# Altium schematic sheet LCD.SchDoc
size A4
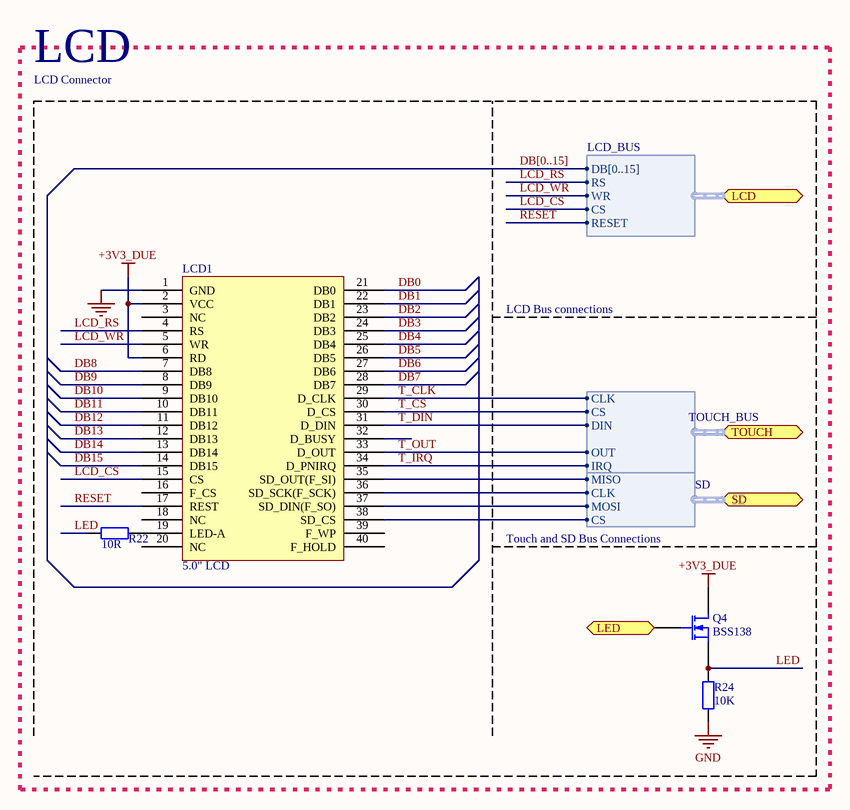
[diagram p0: LCD.SchDoc]

## Parts
LCD1  5.0" LCD  [TFT LCD 5.0 INCHES]
Q4  BSS138  [SOT23]
R22  10R  [RES1206]
R24  10K  [RES1206]

## Ports
LCD (harness LCD_BUS), LED, SD (harness SD), TOUCH (harness TOUCH_BUS)

## Harnesses
LCD_BUS: DB[0..15], RS, WR, CS, RESET
TOUCH_BUS: CLK, CS, DIN, OUT, IRQ
SD: MISO, MOSI, CLK, CS

## Nets
+3V3_DUE: LCD1.2(VCC) LCD1.6(RD) Q4.1(D)
GND: LCD1.1(GND) R24.2
DB0: LCD1.21(DB0)
DB1: LCD1.22(DB1)
DB2: LCD1.23(DB2)
DB3: LCD1.24(DB3)
DB4: LCD1.25(DB4)
DB5: LCD1.26(DB5)
DB6: LCD1.27(DB6)
DB7: LCD1.28(DB7)
DB8: LCD1.7(DB8)
DB9: LCD1.8(DB9)
DB10: LCD1.9(DB10)
DB11: LCD1.10(DB11)
DB12: LCD1.11(DB12)
DB13: LCD1.12(DB13)
DB14: LCD1.13(DB14)
DB15: LCD1.14(DB15)
LCD_CS: LCD1.15(CS) ; port LCD.CS
LCD_RS: LCD1.4(RS) ; port LCD.RS
LCD_WR: LCD1.5(WR) ; port LCD.WR
LED: Q4.2(S) R22.2 R24.1
LED: Q4.3(G) ; port LED  [a separate net that carries the same name]
RESET: LCD1.17(REST) ; port LCD.RESET
T_CLK: LCD1.29(D_CLK) ; port TOUCH.CLK
T_CS: LCD1.30(D_CS) ; port TOUCH.CS
T_DIN: LCD1.31(D_DIN) ; port TOUCH.DIN
T_IRQ: LCD1.34(D_PNIRQ) ; port TOUCH.IRQ
T_OUT: LCD1.33(D_OUT) ; port TOUCH.OUT
NetLCD1_19: LCD1.19(LED-A) R22.1
NetLCD1_35: LCD1.35(SD_OUT(F_SI)) ; port SD.MISO
NetLCD1_36: LCD1.36(SD_SCK(F_SCK)) ; port SD.CLK
NetLCD1_37: LCD1.37(SD_DIN(F_SO)) ; port SD.MOSI
NetLCD1_38: LCD1.38(SD_CS) ; port SD.CS

Not connected (* = marked no-connect by the designer): LCD1 3(NC) 16(F_CS) 18(NC) 20(NC) 32(D_BUSY) 39(F_WP) 40(F_HOLD)

## Buses and harness runs
bus DB[0..15]

## Notes on the sheet
- LCD
- LCD Connector
- LCD Bus connections
- Touch and SD Bus Connections

## Library data of the parts
LCD1 = TFT LCD 5.0 INCHES
Q4 = BSS138: N-Channel Enhancement Mode Vertical DMOS FET; Published: 17-Dec-2003; DatasheetVersion: Mar-96; PackageVersion: 1996; PackageReference: SOT23; Publisher: Altium Limited; PackageDescription: SOT-23; 3 Leads; Body 3.1 x 2.5 mm, inc. leads (LxW max), Alternate Lead Configuration; ComponentLink1Description: Manufacturer Link; ComponentLink1URL: http://www.zetex.com/; ComponentLink2Description: Datasheet; ComponentLink2URL: www.zetex.com/3.0/pdf/BSS138.pdf
R22 R24 = RES